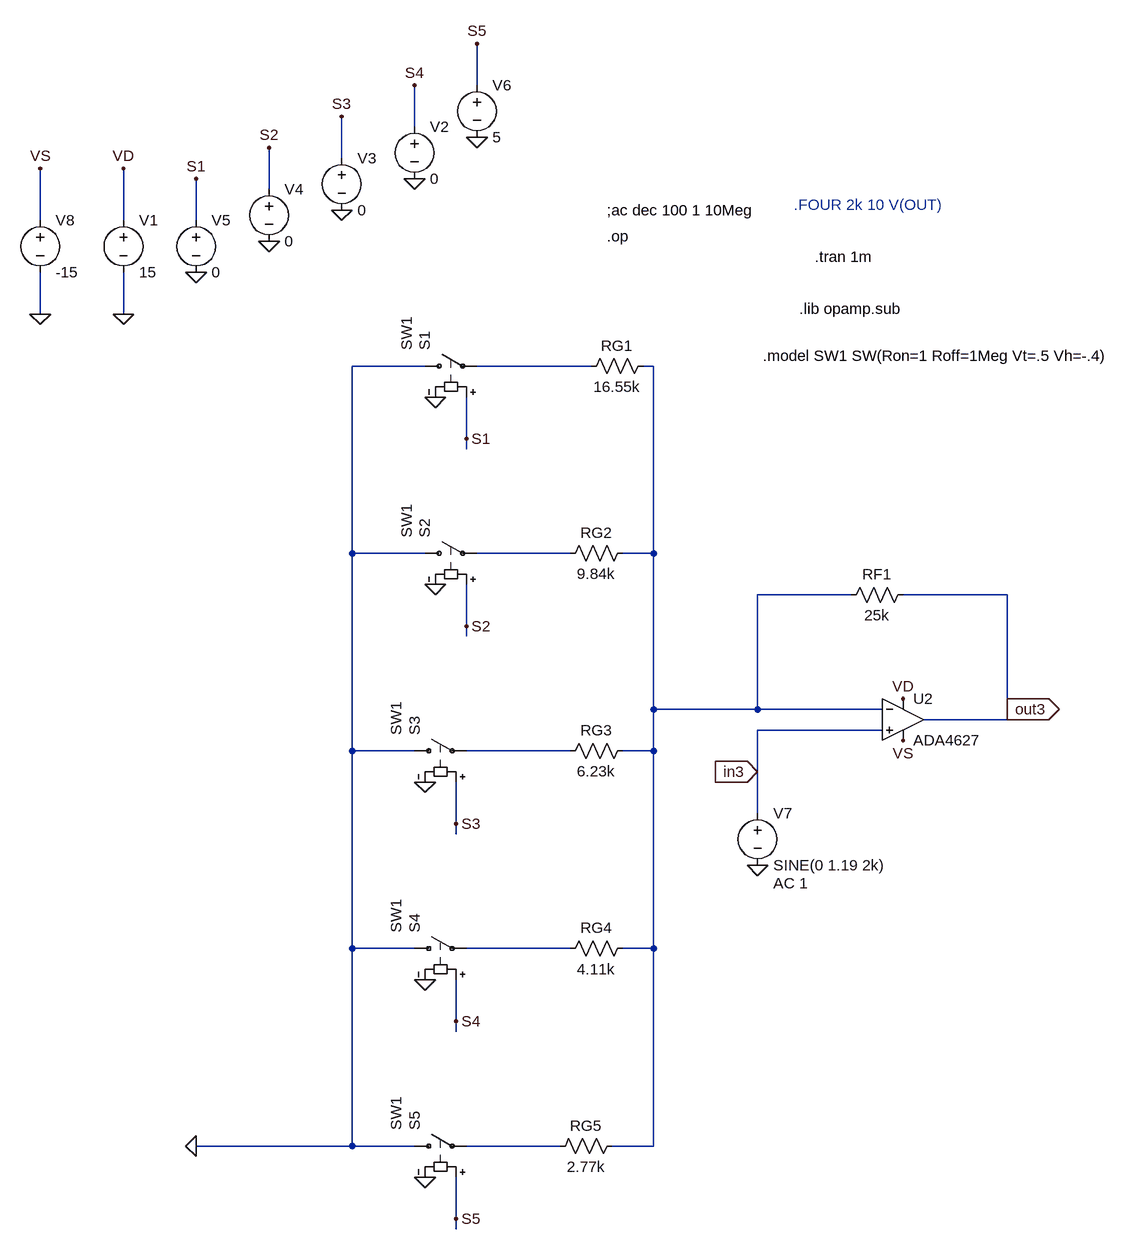
[diagram p0: schematic Etaj3.asc]
Etaj3.asc, the LTspice schematic file:
Version 4
SHEET 1 1720 1244
WIRE -64 -640 -64 -704
WIRE -160 -576 -160 -640
WIRE -272 -528 -272 -592
WIRE -384 -480 -384 -544
WIRE -736 -432 -736 -512
WIRE -608 -432 -608 -512
WIRE -496 -432 -496 -496
WIRE -736 -288 -736 -352
WIRE -608 -288 -608 -352
WIRE -144 -208 -256 -208
WIRE 112 -208 -64 -208
WIRE 208 -208 192 -208
WIRE -80 -96 -80 -160
WIRE -80 -80 -80 -96
WIRE -256 80 -256 -208
WIRE -144 80 -256 80
WIRE 80 80 -64 80
WIRE 208 80 208 -208
WIRE 208 80 160 80
WIRE 512 144 368 144
WIRE 752 144 592 144
WIRE -80 192 -80 128
WIRE -80 208 -80 192
WIRE 208 320 208 80
WIRE 368 320 368 144
WIRE 368 320 208 320
WIRE 560 320 368 320
WIRE 752 320 752 144
WIRE 752 336 752 320
WIRE 752 336 624 336
WIRE 560 352 368 352
WIRE -256 384 -256 80
WIRE -160 384 -256 384
WIRE 80 384 -80 384
WIRE 208 384 208 320
WIRE 208 384 160 384
WIRE 368 416 368 352
WIRE 368 480 368 416
WIRE -96 496 -96 432
WIRE -96 512 -96 496
WIRE -256 688 -256 384
WIRE -160 688 -256 688
WIRE 80 688 -80 688
WIRE 208 688 208 384
WIRE 208 688 160 688
WIRE -96 800 -96 736
WIRE -96 816 -96 800
WIRE -256 992 -256 688
WIRE -256 992 -496 992
WIRE -160 992 -256 992
WIRE 64 992 -80 992
WIRE 208 992 208 688
WIRE 208 992 144 992
WIRE -96 1104 -96 1040
WIRE -96 1120 -96 1104
FLAG -608 -288 0
FLAG -608 -512 VD
FLAG -496 -352 0
FLAG -384 -400 0
FLAG -272 -448 0
FLAG -160 -496 0
FLAG -496 -496 S1
FLAG -384 -544 S2
FLAG -272 -592 S3
FLAG -160 -640 S4
FLAG -64 -560 0
FLAG -64 -704 S5
FLAG 368 560 0
FLAG 592 304 VD
FLAG 592 368 VS
FLAG -496 992 0
FLAG -128 -160 0
FLAG -80 -96 S1
FLAG -128 128 0
FLAG -80 192 S2
FLAG -144 432 0
FLAG -96 496 S3
FLAG -144 736 0
FLAG -96 800 S4
FLAG -144 1040 0
FLAG -96 1104 S5
FLAG -736 -288 0
FLAG -736 -512 VS
FLAG 752 320 out3
IOPIN 752 320 Out
FLAG 368 416 in3
IOPIN 368 416 In
DATAFLAG -496 -464 ""
DATAFLAG -384 -512 ""
DATAFLAG -272 -560 ""
DATAFLAG -160 -608 ""
DATAFLAG -64 -672 ""
SYMBOL res 208 -224 R90
WINDOW 0 0 56 VBottom 2
WINDOW 3 32 56 VTop 2
SYMATTR InstName RG1
SYMATTR Value 16.55k
SYMBOL res 176 64 R90
WINDOW 0 0 56 VBottom 2
WINDOW 3 32 56 VTop 2
SYMATTR InstName RG2
SYMATTR Value 9.84k
SYMBOL res 176 368 R90
WINDOW 0 0 56 VBottom 2
WINDOW 3 32 56 VTop 2
SYMATTR InstName RG3
SYMATTR Value 6.23k
SYMBOL res 176 672 R90
WINDOW 0 0 56 VBottom 2
WINDOW 3 32 56 VTop 2
SYMATTR InstName RG4
SYMATTR Value 4.11k
SYMBOL voltage -608 -448 R0
WINDOW 123 0 0 Left 2
WINDOW 39 0 0 Left 2
SYMATTR InstName V1
SYMATTR Value 15
SYMBOL voltage -160 -592 R0
WINDOW 123 0 0 Left 0
WINDOW 39 0 0 Left 0
SYMATTR InstName V2
SYMATTR Value 0
SYMBOL voltage -272 -544 R0
WINDOW 123 0 0 Left 0
WINDOW 39 0 0 Left 0
SYMATTR InstName V3
SYMATTR Value 0
SYMBOL voltage -384 -496 R0
WINDOW 123 0 0 Left 0
WINDOW 39 0 0 Left 0
SYMATTR InstName V4
SYMATTR Value 0
SYMBOL voltage -496 -448 R0
WINDOW 123 0 0 Left 0
WINDOW 39 0 0 Left 0
SYMATTR InstName V5
SYMATTR Value 0
SYMBOL voltage -64 -656 R0
WINDOW 123 0 0 Left 0
WINDOW 39 0 0 Left 0
SYMATTR InstName V6
SYMATTR Value 5
SYMBOL res 608 128 R90
WINDOW 0 0 56 VBottom 2
WINDOW 3 32 56 VTop 2
SYMATTR InstName RF1
SYMATTR Value 25k
SYMBOL res 160 976 R90
WINDOW 0 0 56 VBottom 2
WINDOW 3 32 56 VTop 2
SYMATTR InstName RG5
SYMATTR Value 2.77k
SYMBOL voltage 368 464 R0
WINDOW 123 24 124 Left 2
WINDOW 39 0 0 Left 0
SYMATTR Value2 AC 1
SYMATTR InstName V7
SYMATTR Value SINE(0 1.19 2k)
SYMBOL sw -160 -208 R270
WINDOW 3 24 -12 Left 2
SYMATTR Value SW1
SYMATTR InstName S1
SYMBOL sw -160 80 R270
WINDOW 3 24 -12 Left 2
SYMATTR Value SW1
SYMATTR InstName S2
SYMBOL sw -176 384 R270
WINDOW 3 24 -12 Left 2
SYMATTR Value SW1
SYMATTR InstName S3
SYMBOL sw -176 688 R270
WINDOW 3 24 -12 Left 2
SYMATTR Value SW1
SYMATTR InstName S4
SYMBOL sw -176 992 R270
WINDOW 3 24 -12 Left 2
SYMATTR Value SW1
SYMATTR InstName S5
SYMBOL voltage -736 -448 R0
WINDOW 123 0 0 Left 2
WINDOW 39 0 0 Left 2
SYMATTR InstName V8
SYMATTR Value -15
SYMBOL OpAmps\\ADA4627 592 272 R0
SYMATTR InstName U2
TEXT 136 -448 Left 2 !;ac dec 100 1 10Meg
TEXT 136 -408 Left 2 !.op
TEXT 424 -456 Left 2 ;.FOUR 2k 10 V(OUT)
TEXT 456 -376 Left 2 !.tran 1m
TEXT 432 -296 Left 2 !.lib opamp.sub
TEXT 376 -224 Left 2 !.model SW1 SW(Ron=1 Roff=1Meg Vt=.5 Vh=-.4)

The netlist it stands for:
* Etaj3.asc
RG1 N002 N001 16.55k
RG2 N002 N003 9.84k
RG3 N002 N004 6.23k
RG4 N002 N005 4.11k
V1 VD 0 15
V2 S4 0 0
V3 S3 0 0
V4 S2 0 0
V5 S1 0 0
V6 S5 0 5
RF1 out3 N002 25k
RG5 N002 N006 2.77k
V7 in3 0 SINE(0 1.19 2k) AC 1
S1 0 N001 S1 0 SW1
S2 0 N003 S2 0 SW1
S3 0 N004 S3 0 SW1
S4 0 N005 S4 0 SW1
S5 0 N006 S5 0 SW1
V8 VS 0 -15
XU2 in3 N002 VD VS out3 ADA4627  ; pins In+ In- V+ V- OUT
;ac dec 100 1 10Meg
.op
* .FOUR 2k 10 V(OUT)
.tran 1m
.lib opamp.sub
.model SW1 SW(Ron=1 Roff=1Meg Vt=.5 Vh=-.4)
.backanno
.end